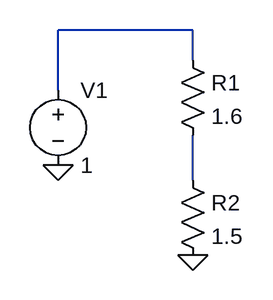
[diagram p0: schematic Draft3.asc]
Draft3.asc, the LTspice schematic file:
Version 4
SHEET 1 880 680
WIRE 320 80 176 80
WIRE 320 112 320 80
WIRE 176 144 176 80
WIRE 320 240 320 192
FLAG 176 224 0
FLAG 320 320 0
SYMBOL voltage 176 128 R0
WINDOW 123 0 0 Left 0
WINDOW 39 0 0 Left 0
SYMATTR InstName V1
SYMATTR Value 1
SYMBOL res 304 96 R0
SYMATTR InstName R1
SYMATTR Value 1.6
SYMBOL res 304 224 R0
SYMATTR InstName R2
SYMATTR Value 1.5

The netlist it stands for:
* Draft3.asc
V1 N001 0 1
R1 N001 N002 1.6
R2 N002 0 1.5
.backanno
.end